# Altium schematic sheet Sintetizador-AD9102.V03.R00.SchDoc: Sintetizador Digital D. Canal X
size A4; SheetNumber: 4; SheetTotal: 18
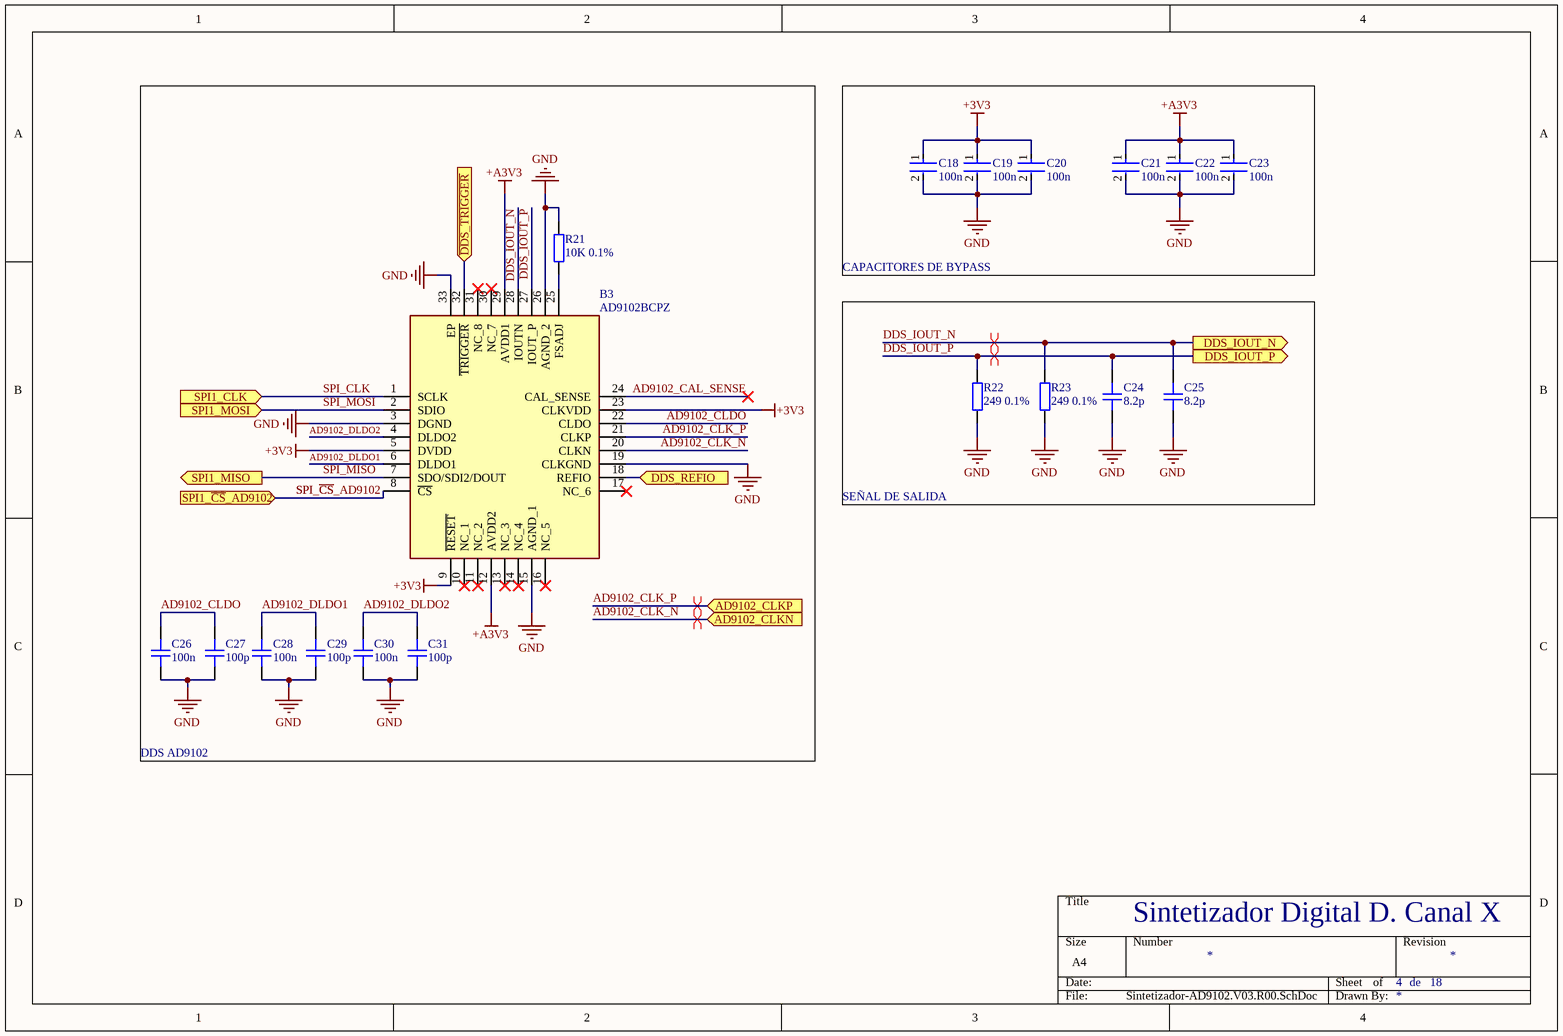
[diagram p0: Sintetizador-AD9102.V03.R00.SchDoc]

## Parts
B3  AD9102BCPZ  [QFN50P500X500X80-33N-D]
C18  100n  [FP-CC0805-EB-MFG]
C19  100n  [FP-CC0805-EB-MFG]
C20  100n  [FP-CC0805-EB-MFG]
C21  100n  [FP-CC0805-EB-MFG]
C22  100n  [FP-CC0805-EB-MFG]
C23  100n  [FP-CC0805-EB-MFG]
C24  8.2p  [CAP_0805]
C25  8.2p  [CAP_0805]
C26  100n  [CAP_0805]
C27  100p  [CAP_0805]
C28  100n  [CAP_0805]
C29  100p  [CAP_0805]
C30  100n  [CAP_0805]
C31  100p  [CAP_0805]
R21  10K 0.1%  [RES_0805]
R22  249 0.1%  [RES_0805]
R23  249 0.1%  [RES_0805]

## Blocks framed on the sheet
DDS AD9102: B3 C26-C31 R21
CAPACITORES DE BYPASS: C18-C23
SEÑAL DE SALIDA: C24 C25 R22 R23

## Ports
AD9102_CLKN (in), AD9102_CLKP (in), DDS_IOUT_N (out), DDS_IOUT_P (out), DDS_REFIO (in), SPI1_CLK (in), SPI1_MISO (out), SPI1_MOSI (in), SPI1_~{CS}_AD9102 (in), ~{DDS_TRIGGER} (in)

## Nets
+3V3: B3.5(DVDD) B3.9(~{RESET}) B3.23(CLKVDD) C18.1 C19.1 C20.1
+A3V3: B3.12(AVDD2) B3.29(AVDD1) C21.1 C22.1 C23.1
GND: B3.3(DGND) B3.15(AGND_1) B3.19(CLKGND) B3.26(AGND_2) B3.33(EP) C18.2 C19.2 C20.2 C21.2 C22.2 C23.2 C24.2 C25.2 C26.1 C27.1 C28.1 C29.1 C30.1 C31.1 R21.2 R22.1 R23.1
~{DDS_TRIGGER}: B3.32(~{TRIGGER}) ; port ~{DDS_TRIGGER}
AD9102_CAL_SENSE: B3.24(CAL_SENSE)
AD9102_CLDO: B3.22(CLDO) C26.2 C27.2
AD9102_CLK_N: B3.20(CLKN) ; port AD9102_CLKN
AD9102_CLK_P: B3.21(CLKP) ; port AD9102_CLKP
AD9102_DLDO1: B3.6(DLDO1) C28.2 C29.2
AD9102_DLDO2: B3.4(DLDO2) C30.2 C31.2
DDS_IOUT_N: B3.28(IOUTN) C25.1 R23.2 ; port DDS_IOUT_N
DDS_IOUT_P: B3.27(IOUT_P) C24.1 R22.2 ; port DDS_IOUT_P
DDS_REFIO: B3.18(REFIO) ; port DDS_REFIO
SPI_~{CS}: B3.8(~{CS}) ; port SPI1_~{CS}_AD9102  [also labelled SPI_~{CS}_AD9102]
SPI_CLK: B3.1(SCLK) ; port SPI1_CLK
SPI_MISO: B3.7(SDO/SDI2/DOUT) ; port SPI1_MISO
SPI_MOSI: B3.2(SDIO) ; port SPI1_MOSI
NetB3_25: B3.25(FSADJ) R21.1

Not connected (* = marked no-connect by the designer): B3 10(NC_1)* 11(NC_2)* 13(NC_3)* 14(NC_4)* 16(NC_5)* 17(NC_6)* 30(NC_7)* 31(NC_8)*

## Layout directives
differential pair: AD9102_CLK_N, AD9102_CLK_P, DDS_IOUT_N, DDS_IOUT_P

## Notes on the sheet
- de

## Library data of the parts
B3 = AD9102BCPZ: Analog Devices AD9102BCPZ, 14 bit Serial DAC, 180Msps, 32-Pin LFCSP; Geometry.Height: 0.8mm; Mouser Part Number: 584-AD9102BCPZ; Mouser Price/Stock: https://www.mouser.co.uk/ProductDetail/Analog-Devices/AD9102BCPZ?qs=%2FtpEQrCGXCx4RM%2FcE0d16g%3D%3D; Manufacturer_Name: Analog Devices; Manufacturer_Part_Number: AD9102BCPZ; Datasheet Link: https://www.analog.com/media/en/technical-documentation/data-sheets/AD9102.pdf
C18-C23 = CMP-00621-107850848-1: CC0805KKX7RYBB104 Capacitor Ceramic 0.01uF 250V X7R 10% 0805 T/R; Capacitance: 100nF; Material: Ceramic; Max Operating Temperature: 125°C; Tolerance: 10%; Case/Package: 0805; NexarPartId: 107850848; Height: 1.45mm; Min Operating Temperature: -55°C; Voltage Rating: 250V
C24-C31 = CAP_0805: Capacitor SMD 0805; Manufacturer: *; Manufacturer Part Number: *; Distributor Link: *; LCSC: *; Rating: *; Dielectric: *
R21-R23 = RES_0805: Resistor SMD 0805; Manufacturer: *; Manufacturer Part Number: *; Distributor Link: *; LCSC: *